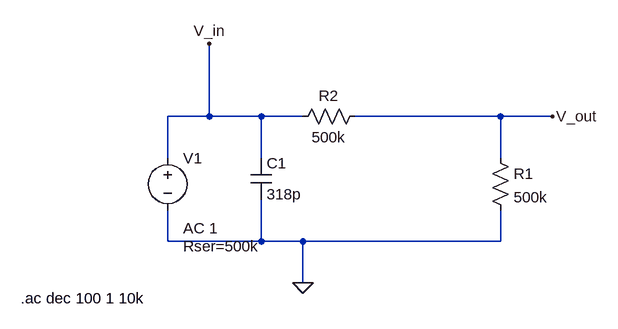
[diagram p0: schematic Filter.asc]
Filter.asc, the LTspice schematic file:
Version 4
SHEET 1 880 680
WIRE -256 32 -256 -80
WIRE -256 32 -320 32
WIRE -176 32 -256 32
WIRE -112 32 -176 32
WIRE 192 32 -32 32
WIRE 272 32 192 32
WIRE -320 96 -320 32
WIRE -176 96 -176 32
WIRE 192 96 192 32
WIRE -320 224 -320 176
WIRE -176 224 -176 160
WIRE -176 224 -320 224
WIRE -112 224 -176 224
WIRE 192 224 192 176
WIRE 192 224 -112 224
WIRE -112 288 -112 224
FLAG -112 288 0
FLAG 272 32 V_out
FLAG -256 -80 V_in
SYMBOL cap -192 96 R0
SYMATTR InstName C1
SYMATTR Value 318p
SYMBOL res 176 80 R0
SYMATTR InstName R1
SYMATTR Value 500k
SYMBOL voltage -320 80 R0
WINDOW 123 24 124 Left 2
WINDOW 39 24 152 Left 2
SYMATTR InstName V1
SYMATTR Value ""
SYMATTR Value2 AC 1
SYMATTR SpiceLine Rser=500k
SYMBOL res -16 16 R90
WINDOW 0 0 56 VBottom 2
WINDOW 3 32 56 VTop 2
SYMATTR InstName R2
SYMATTR Value 500k
TEXT -546 312 Left 2 !.ac dec 100 1 10k

The netlist it stands for:
* Filter.asc
C1 V_in 0 318p
R1 V_out 0 500k
V1 V_in 0 AC 1 Rser=500k
R2 V_out V_in 500k
.ac dec 100 1 10k
.backanno
.end